# EAGLE design modemIO_v1 (EAGLE 6.2)
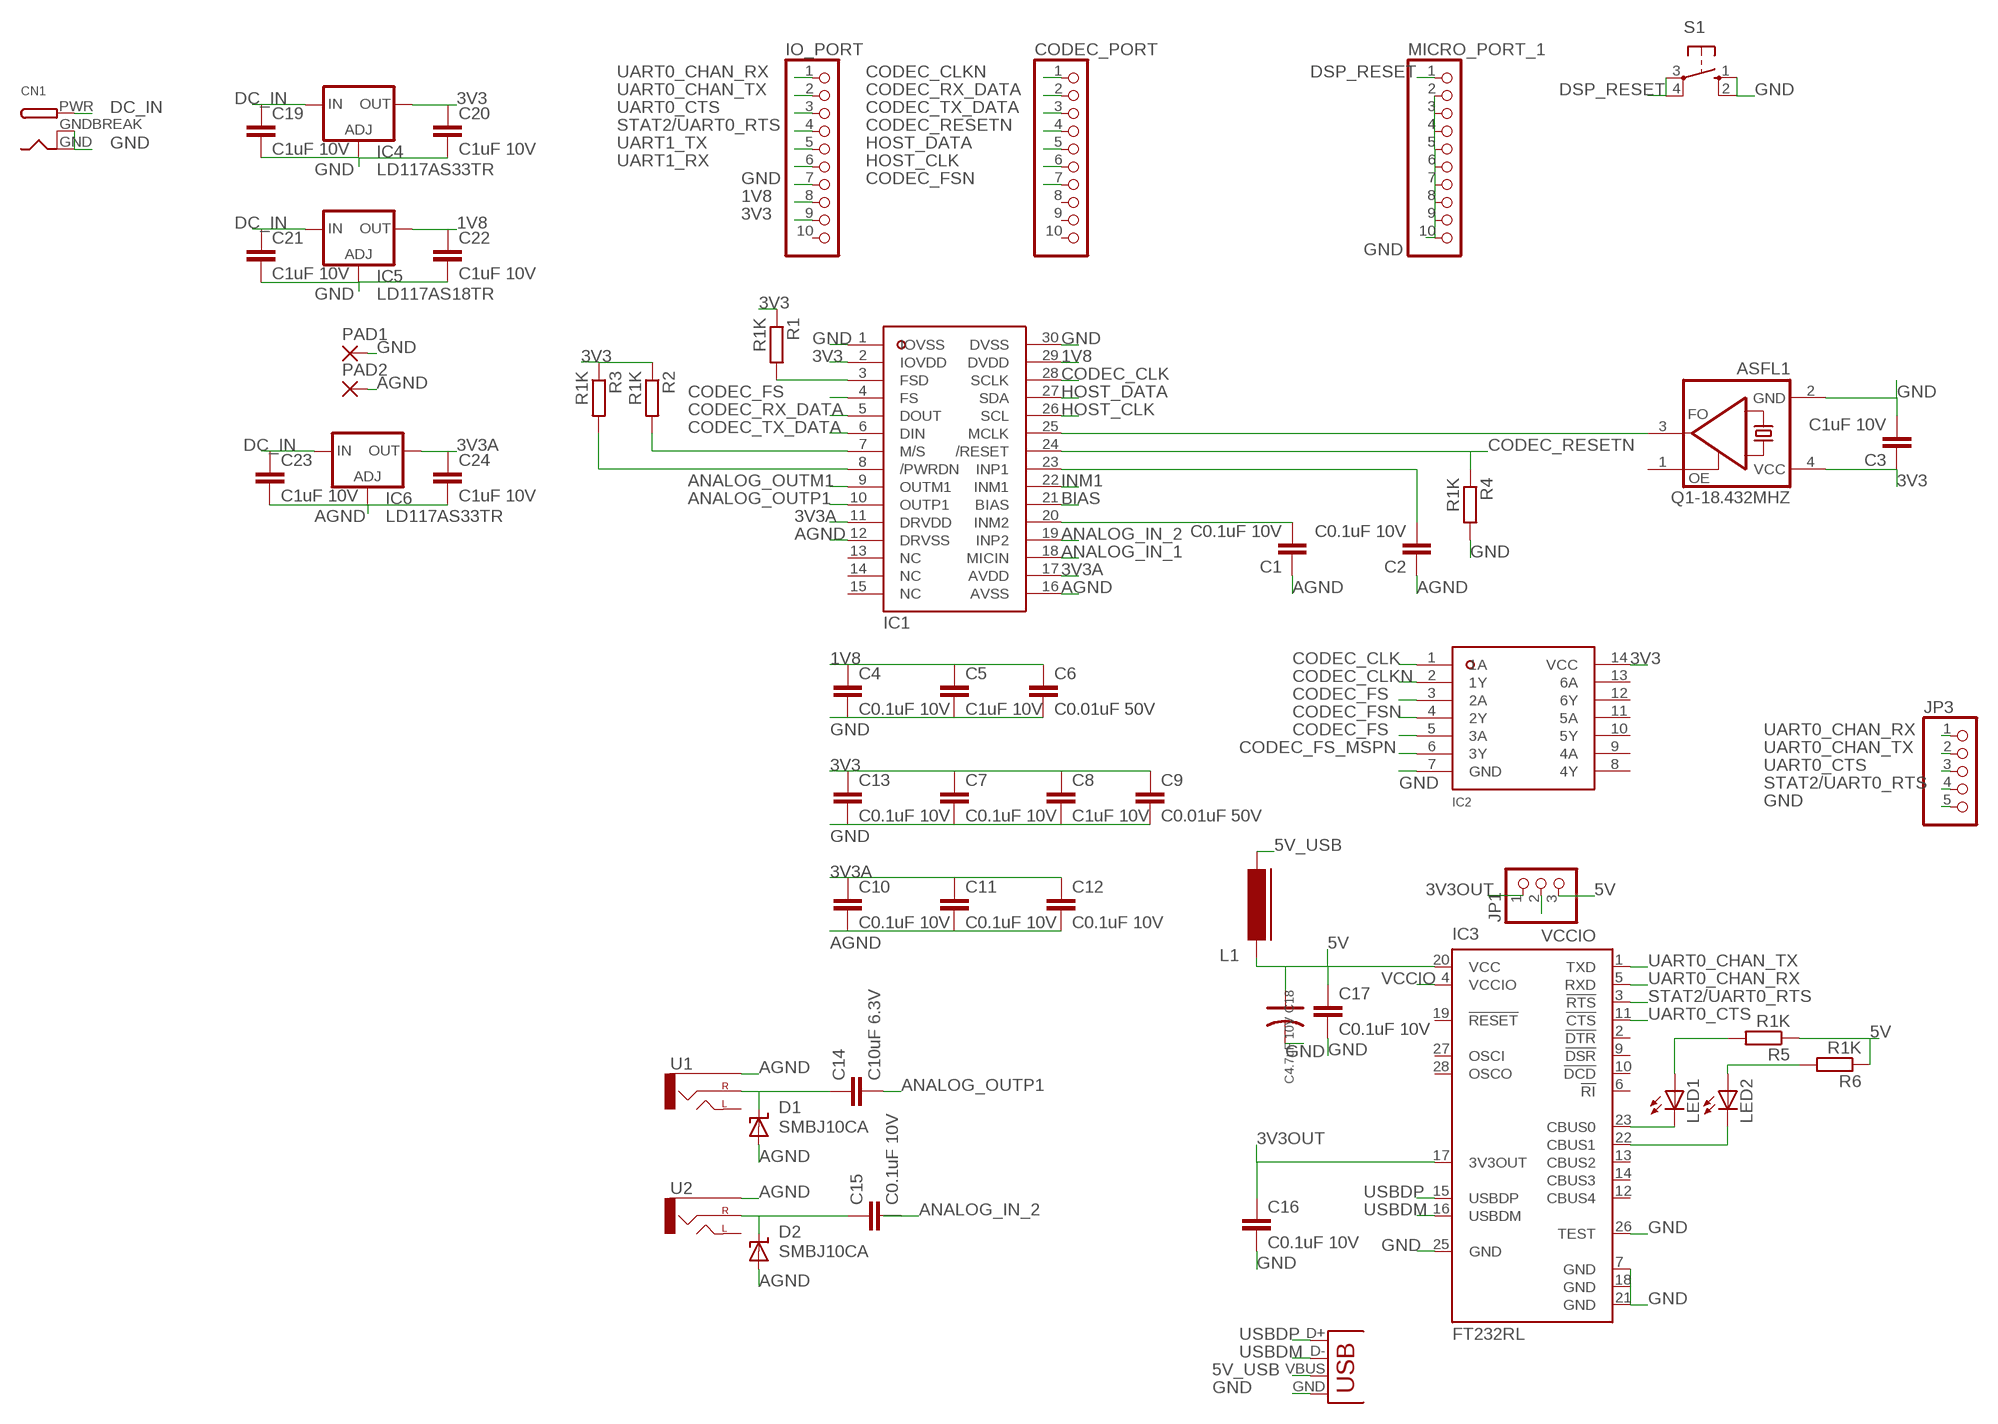
[diagram p0: schematic, sheet 1]

## Parts
C1  C0.1uF 10V  C-EUC0805  [C0805]
C2  C0.1uF 10V  C-EUC0805  [C0805]
C3  C1uF 10V  C-EUC0805  [C0805]
C4  C0.1uF 10V  C-EUC0805  [C0805]
C5  C1uF 10V  C-EUC0805  [C0805]
C6  C0.01uF 50V  C-EUC0805  [C0805]
C7  C0.1uF 10V  C-EUC0805  [C0805]
C8  C1uF 10V  C-EUC0805  [C0805]
C9  C0.01uF 50V  C-EUC0805  [C0805]
C10  C0.1uF 10V  C-EUC0805  [C0805]
C11  C0.1uF 10V  C-EUC0805  [C0805]
C12  C0.1uF 10V  C-EUC0805  [C0805]
C13  C0.1uF 10V  C-EUC0805  [C0805]
C14  C10uF 6.3V  C-EUC0805  [C0805]
C15  C0.1uF 10V  C-EUC0805  [C0805]
C16  C0.1uF 10V  C-EUC0805  [C0805]
C17  C0.1uF 10V  C-EUC0805  [C0805]
C18  C4.7uF 10V  C-POLAR-C  [AVX-C]
C19  C1uF 10V  C-EUC0805  [C0805]
C20  C1uF 10V  C-EUC0805  [C0805]
C21  C1uF 10V  C-EUC0805  [C0805]
C22  C1uF 10V  C-EUC0805  [C0805]
C23  C1uF 10V  C-EUC0805  [C0805]
C24  C1uF 10V  C-EUC0805  [C0805]
CN1  DCBARRELPTH  [DCJACK_2MM_PTH]
CODEC_PORT  PINHD-1X10  [1X10]
D1  SMBJ10CA  SUPPRESSOR-SMBJ  [SMBJ]
D2  SMBJ10CA  SUPPRESSOR-SMBJ  [SMBJ]
IC1  TLV320AIC14R-PDSO-G30  [R-PDSO-G30]
IC2  SN74LVC04ADRR-PDSO-G14  [R-PDSO-G14]
IC3  FT232RL  [SSOP28]
IC4  LD117AS33TR  [SOT223]
IC5  LD117AS18TR  [SOT223]
IC6  LD117AS33TR  [SOT223]
IO_PORT  PINHD-1X10  [1X10]
JP1  PINHD-1X3  [1X03]
JP2  USBSMD  [USB-MINIB]
JP3  PINHD-1X5  [1X05]
L1  FERRITE-0603  [FB603]
LED1  LEDCHIP-LED0805  [CHIP-LED0805]
LED2  LEDCHIP-LED0805  [CHIP-LED0805]
MICRO_PORT_1  PINHD-1X10  [1X10]
PAD1  SMD2  [SMD1,27-2,54]
PAD2  SMD2  [SMD1,27-2,54]
Q1-18.432MHZ  ASFL1  [ASF]
R1  R1K  R-EU_R0805  [R0805]
R2  R1K  R-EU_R0805  [R0805]
R3  R1K  R-EU_R0805  [R0805]
R4  R1K  R-EU_R0805  [R0805]
R5  R1K  R-EU_R0805  [R0805]
R6  R1K  R-EU_R0805  [R0805]
S1  10-XX  [B3F-10XX]
U1  AUDIO-JACKSMD2  [AUDIO-JACK-3.5MM-SMD]
U2  AUDIO-JACKSMD2  [AUDIO-JACK-3.5MM-SMD]

## Nets
1V8: C4.1 C5.1 C6.1 C22.1 IC1.29(DVDD) IC5.4(OUT) IO_PORT.8
3V3: C3.1 C7.1 C8.1 C9.1 C13.1 C20.1 IC1.2(IOVDD) IC2.14(VCC) IC4.4(OUT) IO_PORT.9 Q1-18.432MHZ.4(VCC) R1.1 R2.1 R3.1
3V3A: C10.1 C11.1 C12.1 C24.1 IC1.11(DRVDD) IC1.17(AVDD) IC6.4(OUT)
3V3OUT: C16.1 IC3.17(3V3OUT) JP1.1
5V: C17.1 C18.+ IC3.20(VCC) JP1.3 L1.1 R5.1 R6.1
5V_USB: JP2.VBUS L1.2
AGND: C1.1 C2.1 C10.2 C11.2 C12.2 C23.2 C24.2 D1.A D2.A IC1.12(DRVSS) IC1.16(AVSS) IC6.1(ADJ) PAD2.1(P) U1.SLEEVE U2.SLEEVE
ANALOG_IN_1: IC1.18(MICIN)
ANALOG_IN_2: C15.2 IC1.19(INP2)
ANALOG_OUTM1: IC1.9(OUTM1)
ANALOG_OUTP1: C14.2 IC1.10(OUTP1)
BIAS: IC1.21(BIAS)
CODEC_CLK: IC1.28(SCLK) IC2.1(1A)
CODEC_CLKN: CODEC_PORT.1 IC2.2(1Y)
CODEC_FS: IC1.4(FS) IC2.3(2A) IC2.5(3A)
CODEC_FS_MSPN: IC2.6(3Y)
CODEC_FSN: CODEC_PORT.7 IC2.4(2Y)
CODEC_RESETN: CODEC_PORT.4 IC1.24(/RESET) R4.1
CODEC_RX_DATA: CODEC_PORT.2 IC1.5(DOUT)
CODEC_TX_DATA: CODEC_PORT.3 IC1.6(DIN)
DC_IN: C19.1 C21.1 C23.1 CN1.PWR IC4.3(IN) IC5.3(IN) IC6.3(IN)
DSP_RESET: MICRO_PORT_1.1 S1.3(P) S1.4(P1)
GND: C3.2 C4.2 C5.2 C6.2 C7.2 C8.2 C9.2 C13.2 C16.2 C17.2 C18.- C19.2 C20.2 C21.2 C22.2 CN1.GND CN1.GNDBREAK IC1.1(IOVSS) IC1.30(DVSS) IC2.7(GND) IC3.7(GND) IC3.18(GND) IC3.21(GND) IC3.25(GND) IC3.26(TEST) IC4.1(ADJ) IC5.1(ADJ) IO_PORT.7 JP2.GND JP3.5 MICRO_PORT_1.2 MICRO_PORT_1.3 MICRO_PORT_1.4 MICRO_PORT_1.5 MICRO_PORT_1.6 MICRO_PORT_1.7 MICRO_PORT_1.8 MICRO_PORT_1.9 MICRO_PORT_1.10 PAD1.1(P) Q1-18.432MHZ.2(GND) R4.2 S1.1(S) S1.2(S1)
HOST_CLK: CODEC_PORT.6 IC1.26(SCL)
HOST_DATA: CODEC_PORT.5 IC1.27(SDA)
INM1: IC1.22(INM1)
N$1: C14.1 D1.C U1.RING(RIGHT)
N$2: IC3.23(CBUS0) LED1.C
N$3: IC1.3(FSD) R1.2
N$4: IC3.22(CBUS1) LED2.C
N$5: C15.1 D2.C U2.RING(RIGHT)
N$6: LED1.A R5.2
N$7: IC1.7(M/S) R2.2
N$8: IC1.8(/PWRDN) R3.2
N$9: LED2.A R6.2
N$17: C1.2 IC1.20(INM2)
N$20: C2.2 IC1.23(INP1)
N$22: IC1.25(MCLK) Q1-18.432MHZ.3(FO)
STAT2/UART0_RTS: IC3.3(!RTS) IO_PORT.4 JP3.4
UART0_CHAN_RX: IC3.5(RXD) IO_PORT.1 JP3.1
UART0_CHAN_TX: IC3.1(TXD) IO_PORT.2 JP3.2
UART0_CTS: IC3.11(!CTS) IO_PORT.3 JP3.3
UART1_RX: IO_PORT.6
UART1_TX: IO_PORT.5
USBDM: IC3.16(USBDM) JP2.D-
USBDP: IC3.15(USBDP) JP2.D+
VCCIO: IC3.4(VCCIO) JP1.2
Unconnected: CODEC_PORT.8 CODEC_PORT.9 CODEC_PORT.10 IC1.13(NC) IC1.14(NC) IC1.15(NC) IC2.8(4Y) IC2.9(4A) IC2.10(5Y) IC2.11(5A) IC2.12(6Y) IC2.13(6A) IC3.2(!DTR) IC3.6(!RI) IC3.9(!DSR) IC3.10(!DCD) IC3.12(CBUS4) IC3.13(CBUS2) IC3.14(CBUS3) IC3.19(!RESET) IC3.27(OSCI) IC3.28(OSCO) IO_PORT.10 Q1-18.432MHZ.1(OE) U1.TIP(LEFT) U2.TIP(LEFT)

## Library data of the parts
C1-C17 C19-C24 = resistor:C-EU: CAPACITOR, European symbol
C18 = OPL Eagle Library:C-POLAR*
CN1 = adafruit:DCBARREL: 2.0mm DC Barrel Jack DCJACK_2MM_PTH - Through Hole Jack (4UConnector: 05537)
CODEC_PORT IO_PORT MICRO_PORT_1 = pinhead:PINHD-1X10: PIN HEADER
D1 D2 = diode:SUPPRESSOR-: Suppressor diode
IC1 = TLV320AIC14:TLV320AIC14
IC2 = SN74LVC04ADR:SN74LVC04ADR
IC3 = ftdichip:FT232R: Source: http://www.ftdichip.com/Documents/DataSheets/DS_FT232R_v104.pdf; MPN: FT232RL; OC_FARNELL: 1146032; OC_NEWARK: 91K9918
IC4-IC6 = v-reg:LD117A?*: Low drop fixed and adjustable positive voltage regulators 1 A Source: http://www.st.com/stonline/products/literature/ds/7194/ld1117axx.pdf
JP1 = pinhead:PINHD-1X3: PIN HEADER
JP2 = SparkFun-Connectors:USB: USB Connectors USB-B-PTH is fully proven SKU : PRT-00139/CONN-08278 USB-miniB is fully proven SKU : PRT-00587 USB-A-PCB is untested. USB-A-H is throughly reviewed, but untested. Spark Fun Electronics SKU : PRT-00437 USB-B-SMT is throughly reviewed, but untested. Needs silkscreen touching up. USB-A-S has not been used/tested USB-MB-H has not been used/tested USB-MICROB has been used. CONN-09505
JP3 = pinhead:PINHD-1X5: PIN HEADER
L1 = dp_devices:FERRITE: Ferrite bead in various packages
LED1 LED2 = led:LED: LED OSRAM: - CHIPLED LG R971, LG N971, LY N971, LG Q971, LY Q971, LO R971, LY R971 LH N974, LH R974 LS Q976, LO Q976, LY Q976 LO Q996 - Hyper CHIPLED LW Q18S LB Q993, LB Q99A, LB R99A - SideLED LS A670, LO A670, LY A670, LG A670, LP A670 LB A673, LV A673, LT A673, LW A673 LH A674 LY A675 LS A676, LA A676, LO A676, LY A676, LW A676 LS A679, LY A679, LG A679 - Hyper Micro SIDELED® LS Y876, LA Y876, LO Y876, LY Y876 LT Y87S - SmartLED LW L88C, LW L88S LB L89C, LB L89S, LG L890 LS L89K, LO L89K, LY L89K LS L896, LA L896, LO L896, LY L896 - TOPLED LS T670, LO T670, LY T670, LG T670, LP T670 LSG T670, LSP T670, LSY T670, LOP T670, LYG T670 LG T671, LOG T671, LSG T671 LB T673, LV T673, LT T673, LW T673 LH T674 LS T676, LA T676, LO T676, LY T676, LB T676, LH T676, LSB T676, LW T676 LB T67C, LV T67C, LT T67C, LS T67K, LO T67K, LY T67K, LW E67C LS E67B, LA E67B, LO E67B, LY E67B, LB E67C, LV E67C, LT E67C LW T67C LS T679, LY T679, LG T679 LS T770, LO T770, LY T770, LG T770, LP T770 LB T773, LV T773, LT T773, LW T773 LH T774 LS E675, LA E675, LY E675, LS T675 LS T776, LA T776, LO T776, LY T776, LB T776 LHGB T686 LT T68C, LB T68C - Hyper Mini TOPLED® LB M676 - Mini TOPLED Santana® LG M470 LS M47K, LO M47K, LY M47K Source: http://www.osram.convergy.de LUXEON: - LUMILED® LXK2-PW12-R00, LXK2-PW12-S00, LXK2-PW14-U00, LXK2-PW14-V00 LXK2-PM12-R00, LXK2-PM12-S00, LXK2-PM14-U00 LXK2-PE12-Q00, LXK2-PE12-R00, LXK2-PE12-S00, LXK2-PE14-T00, LXK2-PE14-U00 LXK2-PB12-K00, LXK2-PB12-L00, LXK2-PB12-M00, LXK2-PB14-N00, LXK2-PB14-P00, LXK2-PB14-Q00 LXK2-PR12-L00, LXK2-PR12-M00, LXK2-PR14-Q00, LXK2-PR14-R00 LXK2-PD12-Q00, LXK2-PD12-R00, LXK2-PD12-S00 LXK2-PH12-R00, LXK2-PH12-S00 LXK2-PL12-P00, LXK2-PL12-Q00, LXK2-PL12-R00 Source: www.luxeon.com KINGBRIGHT: KA-3528ASYC Source: www.kingbright.com
PAD1 PAD2 = wirepad:SMD2: SMD PAD
Q1-18.432MHZ = crystal:ASF*: CRYSTAL CLOCK OSCILLATORS 5.0 Vdc or 3.3 Vdc - LOW PROFILE ULTRA MINIATURE CERAMIC SURFACE MOUNT Source: http://www.abracon.com/Oscillators/asf1-L-L1.pdf; MF: Abracon Corporation; MPN: ASFL1-125.000MHZ-EC-T; OC_FARNELL: 1838931; OC_NEWARK: 19M1882
R1-R6 = resistor:R-EU_: RESISTOR, European symbol
S1 = switch-omron:10-XX: OMRON SWITCH; MPN: B3F-1000; OC_FARNELL: 176432; OC_NEWARK: 36M3542
U1 U2 = SparkFun-Connectors:AUDIO-JACK: 3.5mm Audio Jack Simple 3.5mm common PCB mount audio jack. SKU: PRT-08032

## Board
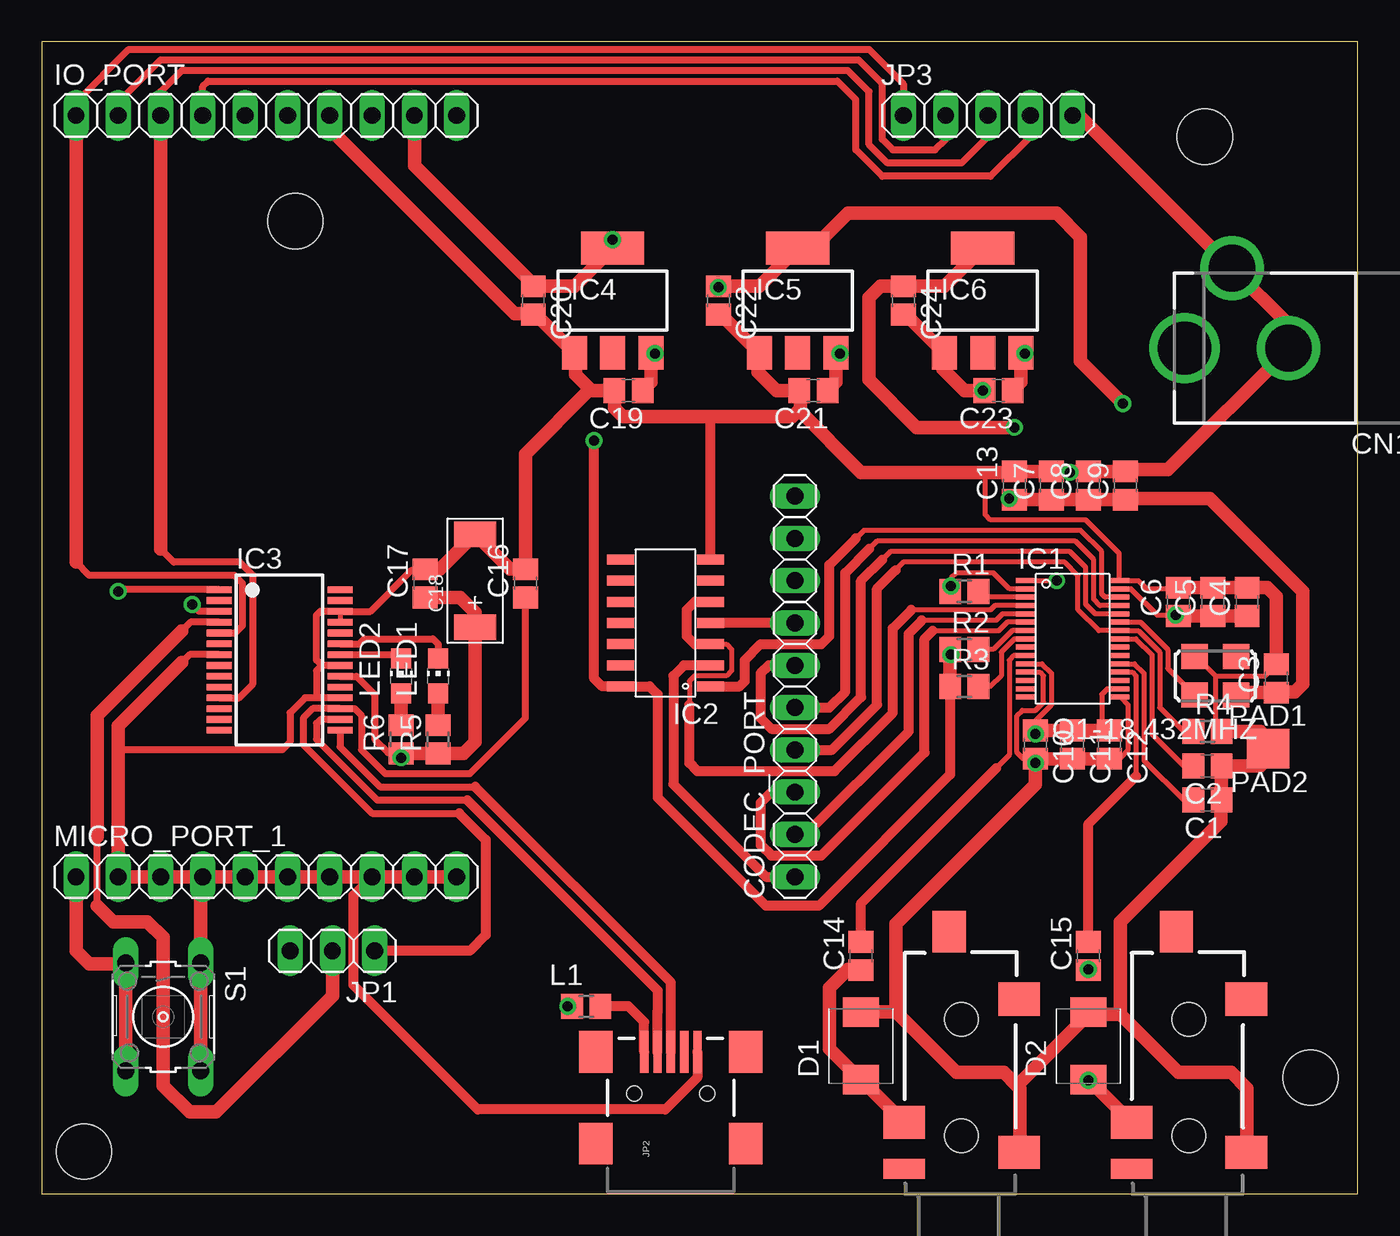
[diagram p1: board, top side]
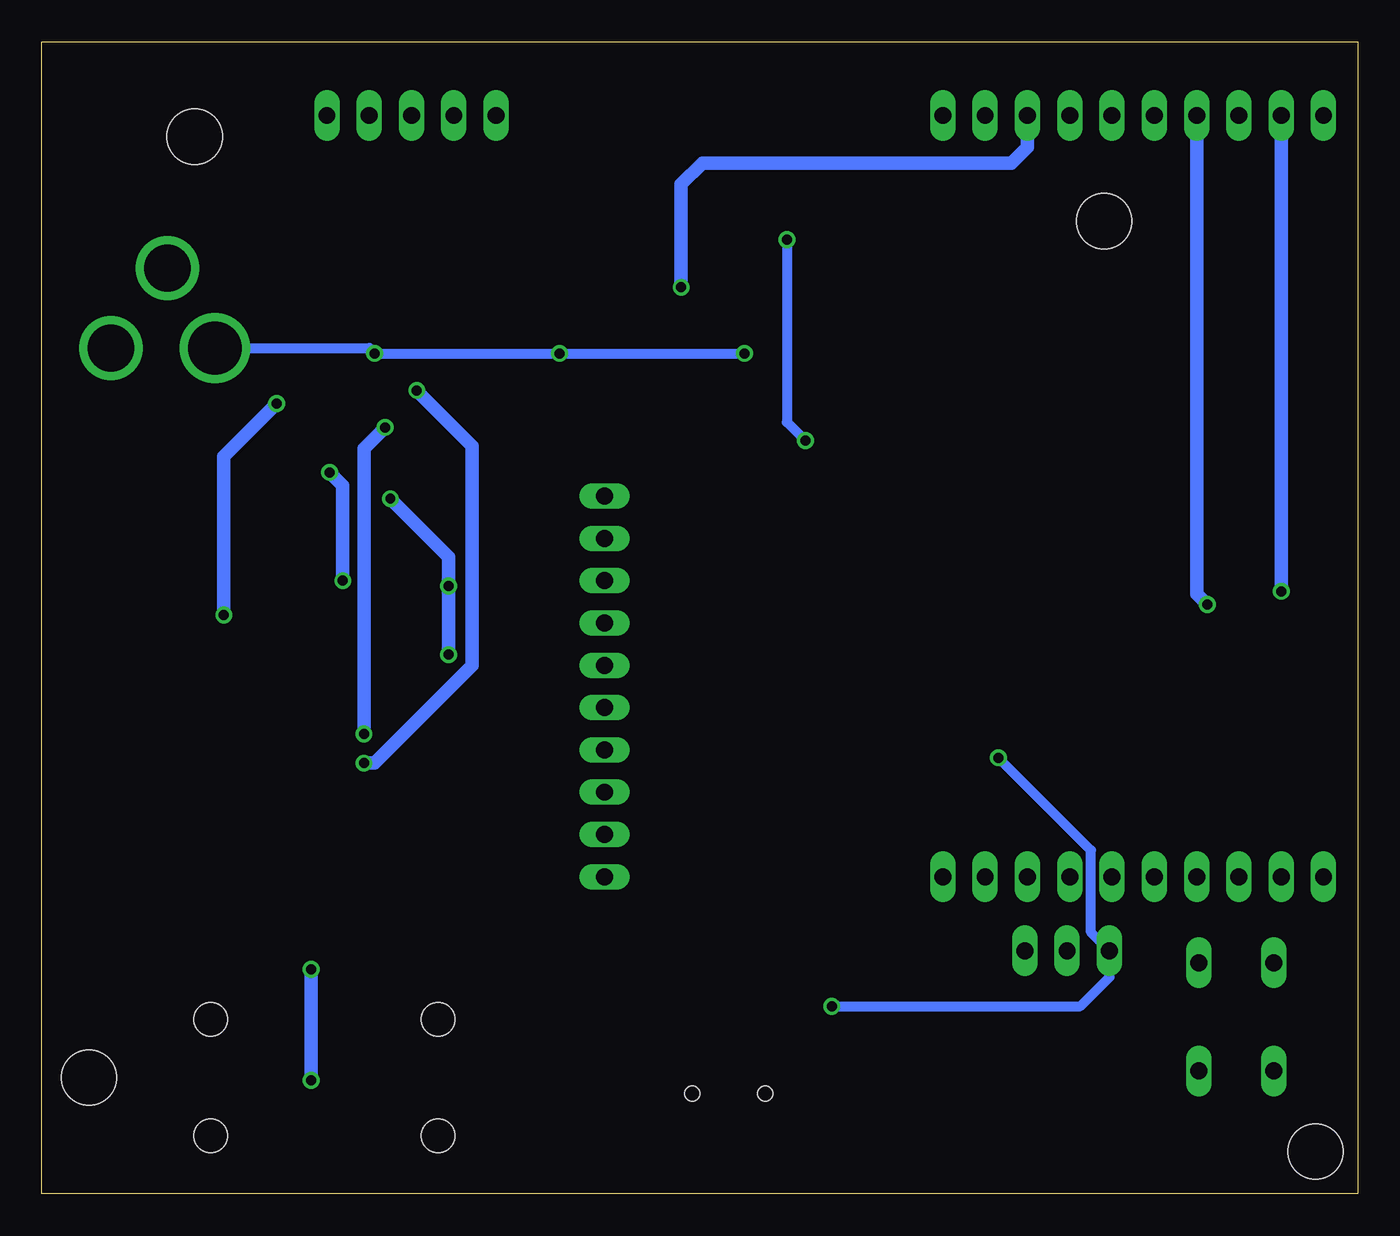
[diagram p2: board, bottom side, seen from below]

Size 79.05 x 69.2 mm. Coordinates in mm from the lower left corner, seen from the top.
Outline: 0,0 79.05,0 79.05,69.2 0,69.2 0,0
Copper layers (1*16): Top 0.035mm / dielectric 1.5mm / Bottom 0.035mm
Design rules: minimum track width 10mil, minimum drill 24mil, track to track 8mil, track to pad 8mil, pad to pad 8mil, via to via 8mil, smd to smd 8mil, copper to edge 40mil, drill to drill 8mil, minimum pad ring 10mil, minimum via ring 8mil, stop-mask expansion 4mil, vias tented up to drill 0mil, thermal gap 10mil
Holes 3.3 mm at 2.54,2.54 76.2,6.99 69.85,63.5 15.24,58.42

### Footprints (pad centres in the part's own frame; a part is rotated, then mirrored left to right if it is on the bottom)
C0805 = smd 1.3 x 1.5: 1 -0.85,0; 2 0.85,0
AVX-C = smd 1.524 x 2.54: + -2.794,0; - 2.794,0
DCJACK_2MM_PTH = drill 2.8: GND 0,7.35; GNDBREAK 4.8,10.75 | drill 3.2: PWR 0,13.6
1X10 = drill 1.016 long: 1 -11.43,0; 2 -8.89,0; 3 -6.35,0; 4 -3.81,0; 5 -1.27,0; 6 1.27,0; 7 3.81,0; 8 6.35,0; 9 8.89,0; 10 11.43,0
SMBJ = smd 1.78 x 2.16: A 2.04,0; C -2.03,0
R-PDSO-G30 = smd 0.3 x 1.2: 1 -3.5,-2.8; 2 -3,-2.8; 3 -2.5,-2.8; 4 -2,-2.8; 5 -1.5,-2.8; 6 -1,-2.8; 7 -0.5,-2.8; 8 0,-2.8; 9 0.5,-2.8; 10 1,-2.8; 11 1.5,-2.8; 12 2,-2.8; 13 2.5,-2.8; 14 3,-2.8; 15 3.5,-2.8; 16 3.5,2.8; 17 3,2.8; 18 2.5,2.8; 19 2,2.8; 20 1.5,2.8; 21 1,2.8; 22 0.5,2.8; 23 0,2.8; 24 -0.5,2.8; 25 -1,2.8; 26 -1.5,2.8; 27 -2,2.8; 28 -2.5,2.8; 29 -3,2.8; 30 -3.5,2.8
R-PDSO-G14 = smd 0.6 x 1.6: 1 -3.81,-2.7; 2 -2.54,-2.7; 3 -1.27,-2.7; 4 0,-2.7; 5 1.27,-2.7; 6 2.54,-2.7; 7 3.81,-2.7; 8 3.81,2.7; 9 2.54,2.7; 10 1.27,2.7; 11 0,2.7; 12 -1.27,2.7; 13 -2.54,2.7; 14 -3.81,2.7
SSOP28 = smd 0.4 x 1.5: 1 -4.225,-3.625; 2 -3.575,-3.625; 3 -2.925,-3.625; 4 -2.275,-3.625; 5 -1.625,-3.625; 6 -0.975,-3.625; 7 -0.325,-3.625; 8 0.325,-3.625; 9 0.975,-3.625; 10 1.625,-3.625; 11 2.275,-3.625; 12 2.925,-3.625; 13 3.575,-3.625; 14 4.225,-3.625; 15 4.225,3.625; 16 3.575,3.625; 17 2.925,3.625; 18 2.275,3.625; 19 1.625,3.625; 20 0.975,3.625; 21 0.325,3.625; 22 -0.325,3.625; 23 -0.975,3.625; 24 -1.625,3.625; 25 -2.275,3.625; 26 -2.925,3.625; 27 -3.575,3.625; 28 -4.225,3.625
SOT223 = smd 1.5 x 2: 1 -2.3,-3.15; 2 0,-3.15; 3 2.3,-3.15 | smd 3.8 x 2: 4 0,3.15
1X03 = drill 1.016 long: 1 -2.54,0; 2 0,0; 3 2.54,0
USB-MINIB = smd 2.5 x 0.5: D+ 2.5,0; D- 2.5,0.8; GND 2.5,-1.6; ID 2.5,-0.8; VBUS 2.5,1.6 | smd 2.5 x 2: MTN1 -3,4.5; MTN2 2.5,4.5; MTN3 -3,-4.5; MTN4 2.5,-4.5 | hole 0.9: 0,2.2; 0,-2.2
1X05 = drill 1.016 long: 1 -5.08,0; 2 -2.54,0; 3 0,0; 4 2.54,0; 5 5.08,0
FB603 = smd 1.3 x 1.5: 1 -0.85,0; 2 0.85,0
CHIP-LED0805 = smd 1.2 x 1.2: A 0,-1.05; C 0,1.05
SMD1,27-2,54 = smd 1.27 x 2.54: 1 0,0
ASF = smd 1.6 x 1.5: 1 -1.25,-1.15; 2 1.25,-1.15; 3 1.25,1.15; 4 -1.25,1.15
R0805 = smd 1.3 x 1.5: 1 -0.85,0; 2 0.85,0
B3F-10XX = drill 1.016 long: 1 -3.251,2.261; 2 3.251,2.261; 3 -3.251,-2.261; 4 3.251,-2.261
AUDIO-JACK-3.5MM-SMD = smd 2 x 2.5: RING 4.3,3.45; SLEEVE 2.5,-3.45; TIP 11.7,-3.45 | smd 1.2 x 2.5: RSH 1.5,3.45 | smd 2.5 x 2: TSH 15.75,0.75 | hole 2: 3.5,0; 10.5,0

### Placement (x,y rotation side)
C1  70.01,23.65 180 top
C2  70.01,25.72 180 top
C3  74.14,30.96 90 top
C4  72.39,35.56 90 top
C5  70.33,35.56 90 top
C6  68.26,35.56 90 top
C7  60.64,42.55 90 top
C8  62.87,42.55 90 top
C9  65.09,42.55 90 top
C10  59.69,26.99 270 top
C11  61.91,26.99 270 top
C12  64.14,26.99 270 top
C13  58.42,42.55 90 top
C14  49.21,14.29 90 top
C15  62.87,14.29 90 top
C16  29.05,36.67 90 top
C17  23.02,36.67 90 top
C18  26.04,36.83 90 top
C19  35.24,48.26 180 top
C20  29.53,53.66 270 top
C21  46.35,48.26 180 top
C22  40.64,53.66 270 top
C23  57.47,48.26 180 top
C24  51.75,53.66 270 top
CN1  82.23,50.8 90 top
CODEC_PORT  45.24,30.48 90 top
D1  49.21,8.89 90 top
D2  62.87,8.89 90 top
IC1  61.91,33.34 270 top
IC2  37.47,34.29 90 top
IC3  14.29,32.07 270 top
IC4  34.29,53.66 0 top
IC5  45.4,53.66 0 top
IC6  56.52,53.66 0 top
IO_PORT  13.49,64.77 0 top
JP1  17.46,14.61 180 top
JP2  37.78,6.03 90 top
JP3  56.83,64.77 0 top
L1  32.7,11.27 0 top
LED1  23.81,31.11 0 top
LED2  21.59,31.11 0 top
MICRO_PORT_1  13.49,19.05 0 top
PAD1  73.66,27.3 270 top
PAD2  73.66,26.19 90 top
Q1-18.432MHZ  70.48,31.11 180 top
R1  55.4,36.2 0 top
R2  55.4,32.7 0 top
R3  55.4,30.48 0 top
R4  70.01,27.78 0 top
R5  23.81,27.3 90 top
R6  21.59,27.3 90 top
S1  7.3,10.64 270 top
U1  55.24,0 90 top
U2  68.9,0 90 top

### Tracks (layer width: path | path; a pad name or v marks a point on that pad's centre or on a via)
1V8  (via drill 0.6)
  Top 0.305: IC1.29 65.42,36.34 66.99,34.77 v68.1,34.77
  Top 0.813: C4.1 C5.1 C6.1 68.21,34.77 v68.1,34.77 | v64.93,47.47 62.39,50.01 62.39,57.47 60.96,58.9 48.42,58.9 46.33,56.81 IC5.4 43.1,54.51 C22.1 v40.64,54.45
  Bottom 0.813: IO_PORT.8 19.84,62.87 20.8,61.91 39.37,61.91 40.64,60.64 v40.64,54.45 | v68.1,34.77 68.1,44.29 v64.93,47.47
3V3  (via drill 0.6)
  Top 0.305: IC1.2 58.12,36.34 57.15,37.31 54.93,37.31 54.61,36.99 v54.61,36.51 54.61,36.25 R1.1
  Top 0.61: R3.1 54.55,25.18 46.67,17.3 43.5,17.3 36.99,23.81 36.99,30 36.51,30.48 IC2.14 33.66,30.48 33.18,30.96 v33.18,45.24 | v34.29,57.31 IC4.4
  Top 0.813: Q1-18.432MHZ.4 71.88,30.11 C3.1 74.19,30.16 75.25,30.16 75.72,30.64 75.72,36.2 70.17,41.75 65.14,41.75 C9.1 C8.1 C7.1 C13.1 58.36,41.75 v58.1,41.75 | IC4.4 31.99,54.51 C20.1 29.21,54.83 29.21,54.93 22.38,61.75 IO_PORT.9 | R3.1 54.55,32.33 v54.61,32.38 54.55,32.44 R2.1
  Bottom 0.61: v34.29,57.31 34.29,46.35 v33.18,45.24
  Bottom 0.813: v54.61,32.38 v54.61,36.51 54.61,38.26 v58.1,41.75
3V3A  (via drill 0.6)
  Top 0.305: C10.1 59.69,28.42 60.64,29.37 60.64,31.27 60.08,31.84 IC1.11 | IC1.17 63.99,30.34 63.66,30 63.66,28.31 C12.1
  Top 0.813: C12.1 C11.1 C10.1 v59.69,27.62 | IC6.4 54.22,54.51 C24.1 50.38,54.51 49.69,53.82 49.69,48.9 52.55,46.04 v58.42,46.04
  Bottom 0.813: v59.69,27.62 59.69,44.77 v58.42,46.04
3V3OUT
  Top 0.406: C16.1 29.05,28.57 25.72,25.24 20.64,25.24 19.21,26.67 19.21,28.73 18.8,29.14 IC3.17 16.28,29.14 15.72,28.57 15.72,26.99 19.84,22.86 25.08,22.86
  Top 0.61: JP1.1 25.72,14.61 26.67,15.56 26.67,21.27 25.08,22.86
5V  (via drill 0.6)
  Top 0.406: IC3.20 18.91,31.09 20,30 20,27.3 20.8,26.51 21.53,26.51 R6.1
  Top 0.813: C17.1 25.14,35.82 26.04,34.92 C18.+ 26.04,27.15 25.34,26.45 R5.1 R6.1 v21.59,26.19 | v31.59,11.27 L1.1
  Bottom 0.61: v21.59,26.19 16.03,20.64 16.03,15.72 JP1.3 14.92,13.02 16.67,11.27 v31.59,11.27
5V_USB
  Top 0.61: JP2.VBUS 36.18,10.33 35.24,11.27 L1.2
AGND  (via drill 0.6)
  Top 0.305: IC1.16 64.78,29.84 65.25,29.37 65.25,26.67 64.77,26.19 64.19,26.19 C12.2 | C10.2 58.95,26.14 58.58,26.51 58.58,28.73 58.9,29.05 59.69,29.05 60.17,29.53 60.17,31.11 59.94,31.34 IC1.12
  Top 0.813: 51.3,10.93 54.93,7.3 57.78,7.3 58.58,6.51 | 58.58,6.51 58.74,6.35 58.74,2.54 U1.SLEEVE | D2.A 62.87,10.79 | 62.87,10.79 58.58,6.51 | 62.87,10.79 64.77,10.79 | 64.77,10.79 68.26,7.3 71.44,7.3 72.39,6.35 72.39,2.54 U2.SLEEVE | C12.2 C11.2 C10.2 59.53,25.98 59.59,25.98 v59.69,25.88 59.69,24.61 51.3,16.22 51.3,10.93 | 64.77,10.79 64.77,16.35 70.8,22.38 70.8,23.6 C1.1 C2.1 73.18,25.72 PAD2.1 | 51.3,10.93 D1.A | C24.2 51.91,52.81 IC6.1 54.13,50.43 54.13,49.53 55.4,48.26 v56.52,48.26 C23.2
  Bottom 0.813: v59.69,25.88 59.05,25.88 53.18,31.75 53.18,44.93 v56.52,48.26
ANALOG_IN_2
  Top 0.305: IC1.19 65.5,31.34 65.72,31.11 65.72,25.08
  Top 0.61: C15.2 62.87,22.23 65.72,25.08
ANALOG_OUTP1
  Top 0.305: IC1.10 58.37,32.34 58.1,32.07 58.1,26.35 57.31,25.56
  Top 0.61: C14.2 49.21,17.46 57.31,25.56
CODEC_CLK
  Top 0.305: IC1.28 63.86,35.84 63.66,36.04 63.66,38.58 62.39,39.85 49.37,39.85 48.9,39.37
  Top 0.61: 48.9,39.37 47.31,37.78 47.31,33.5 46.83,33.02 43.18,33.02 42.23,32.07 42.23,30.8 41.91,30.48 IC2.1
CODEC_CLKN
  Top 0.61: IC2.2 38.58,31.75 37.94,31.11 37.94,24.61 43.5,19.05 CODEC_PORT.1
CODEC_FS
  Top 0.305: IC1.4 57.24,35.34 56.99,35.08 52.23,35.08 | IC2.3 41.12,33.02 41.43,32.7 41.43,31.43 41.12,31.11 39.21,31.11 38.89,30.8 38.89,29.37
  Top 0.61: 52.23,35.08 51.12,33.97 51.12,28.89 47.62,25.4 39.37,25.4 38.89,25.88 38.89,29.37 | IC2.5 39.21,35.56 38.73,35.08 38.73,33.5 39.21,33.02 IC2.3
CODEC_FSN
  Top 0.61: CODEC_PORT.7 IC2.4
CODEC_RESETN
  Top 0.305: R4.1 68.58,27.78 67.15,29.21 67.15,32.54 65.86,33.84 IC1.24 63.48,33.84 62.23,35.08 62.23,37.15 61.44,37.94 51.75,37.94 51.28,37.47
  Top 0.61: CODEC_PORT.4 47.47,26.67 50.16,29.37 50.16,36.35 51.28,37.47
CODEC_RX_DATA
  Top 0.305: IC1.5 57.7,34.84 57.31,34.45 52.86,34.45
  Top 0.61: CODEC_PORT.2 45.88,21.59 52.07,27.78 52.07,33.66 52.86,34.45
CODEC_TX_DATA
  Top 0.305: IC1.6 57.99,34.34 57.47,33.81 53.5,33.81
  Top 0.61: CODEC_PORT.3 43.81,24.13 43.18,23.5 43.18,20.95 43.81,20.32 46.83,20.32 53.02,26.51 53.02,33.34 53.5,33.81
DC_IN  (via drill 0.6)
  Top 0.813: C19.1 36.59,48.76 IC4.3 36.62,50.48 v36.83,50.48 | C21.1 47.7,48.76 IC5.3 47.92,50.51 v47.94,50.48 | C23.1 58.81,48.76 IC6.3 58.84,50.48 v59.05,50.48
  Bottom 0.61: v36.83,50.48 v47.94,50.48 v59.05,50.48 59.37,50.8 CN1.PWR
DSP_RESET
  Top 0.813: MICRO_PORT_1.1 2.06,14.61 2.86,13.81 4.97,13.81 S1.3 S1.4
GND  (via drill 0.6)
  Top 0.305: C6.2 68.21,36.35 66.36,36.35 65.87,36.84 IC1.30 64.71,38.48 62.71,40.48 56.99,40.48 56.67,40.8 56.67,43.34 | Q1-18.432MHZ.2 69.33,32.27 70.48,31.11 | 70.48,31.11 70.48,28.16 R4.2 | IC3.26 IC3.25 | 70.48,31.11 73.44,31.11 C3.2 | IC1.1 v60.95,36.84 v60.96,36.83
  Top 0.406: C17.2 22.96,37.47 22.23,37.47 19.75,34.99 IC3.26 16.74,34.99 16.51,34.77 16.51,32.07 16.82,31.76 16.82,31.74 | IC3.21 16.82,31.74 | 16.82,31.74 16.51,31.43 16.51,29.79 | IC3.7 8.9,32.39 8.41,31.91 | IC3.18 16.51,29.79 | 16.51,29.79 15.82,29.79 14.92,28.89 14.92,27.15 14.45,26.67 4.6,26.67
  Top 0.61: JP2.GND 39.38,7 37.47,5.08 26.19,5.08 18.73,12.54 18.73,17.94 MICRO_PORT_1.8 | IC2.7 40.16,46.67
  Top 0.813: C6.2 C5.2 C4.2 73.6,36.41 74.14,35.88 C3.2 | MICRO_PORT_1.4 9.56,18.93 S1.1 S1.2 | C17.2 23.93,37.52 C18.- 28.14,37.52 C16.2 29.05,44.45 32.94,48.34 | 8.41,31.91 4.6,28.1 4.6,26.67 MICRO_PORT_1.2 MICRO_PORT_1.3 MICRO_PORT_1.4 | MICRO_PORT_1.4 MICRO_PORT_1.5 MICRO_PORT_1.6 MICRO_PORT_1.7 MICRO_PORT_1.8 MICRO_PORT_1.9 MICRO_PORT_1.10 | 32.94,48.34 33.02,48.26 C19.2 34.39,47.2 34.92,46.67 40.16,46.67 45.09,46.67 45.48,47.07 | 32.94,48.34 32.07,49.21 32.07,50.43 IC4.1 29.69,52.81 C20.2 29.47,52.86 28.42,52.86 17.3,63.98 IO_PORT.7 | C22.2 40.8,52.81 IC5.1 43.02,50.43 43.02,49.37 44.13,48.26 C21.2 45.56,48.2 45.56,47.15 45.48,47.07 | JP3.5 62.31,64.77 CN1.GNDBREAK 74.88,52.2 CN1.GND 74.88,50.75 67.63,43.5 65.19,43.5 C9.2 C8.2 61.81,43.4 v61.75,43.34 61.7,43.4 C7.2 C13.2 58.36,43.34 56.67,43.34 49.21,43.34 45.48,47.07 | R4.2 73.18,27.78 PAD1.1
  Bottom 0.813: v60.96,36.83 60.96,42.55 v61.75,43.34
HOST_CLK
  Top 0.305: IC1.26 63.27,34.84 62.71,35.4 62.71,37.62 61.75,38.58 50.96,38.58 50.48,38.1
  Top 0.61: CODEC_PORT.6 43.66,31.75 43.18,31.27 43.18,28.57 43.81,27.94 47.31,27.94 49.21,29.84 49.21,36.83 50.48,38.1
HOST_DATA
  Top 0.305: IC1.27 63.56,35.34 63.18,35.72 63.18,38.1 62.07,39.21 50.16,39.21 49.69,38.73
  Top 0.61: CODEC_PORT.5 47.31,29.21 48.26,30.16 48.26,37.31 49.69,38.73
N$1
  Top 0.813: U1.RING 49.23,6.86 D1.C 49.18,6.86 47.31,8.73 47.31,12.38 48.42,13.49 49.16,13.49 C14.1
N$2
  Top 0.406: IC3.23 19.07,33.04 19.37,33.34 23.5,33.34 23.81,33.02 LED1.C
N$3
  Top 0.305: IC1.3 56.61,35.84 R1.2
N$4
  Top 0.406: IC3.22 21.36,32.39 LED2.C
N$5  (via drill 0.6)
  Top 0.61: v62.87,13.49 C15.1
  Top 0.813: U2.RING 62.89,6.86 D2.C v62.87,6.83
  Bottom 0.813: v62.87,13.49 v62.87,6.83
N$6
  Top 0.813: LED1.A R5.2
N$7
  Top 0.305: IC1.7 58.28,33.84 57.15,32.7 R2.2
N$8
  Top 0.305: IC1.8 58.42,33.34 57.63,32.54 57.63,31.11 56.99,30.48 R3.2
N$9
  Top 0.813: LED2.A R6.2
N$17
  Top 0.305: IC1.20 65.64,31.84 66.2,31.27 66.2,26.04 68.58,23.65 C1.2
N$20
  Top 0.305: IC1.23 65.72,33.34 66.67,32.38 66.67,27.62 68.58,25.72 C2.2
N$22
  Top 0.305: IC1.25 65.99,34.34 67.63,32.7 67.63,31.57 Q1-18.432MHZ.3
STAT2/UART0_RTS  (via drill 0.6)
  Top 0.406: IO_PORT.4 9.68,66.52 10,66.83 47.78,66.83 48.9,65.72 48.9,62.71 50.48,61.12 56.99,61.12 59.37,63.5 JP3.4 | IC3.3 9.46,34.99 v9.05,35.4
  Bottom 0.813: IO_PORT.4 9.68,36.04 v9.05,35.4
UART0_CHAN_RX
  Top 0.406: IO_PORT.1 2.06,65.56 5.24,68.74 49.69,68.74 51.75,66.67 JP3.1 | IC3.5 11.63,33.69 12.06,34.13 12.06,36.67 11.59,37.15 2.86,37.15 2.06,37.94
  Top 0.813: IO_PORT.1 2.06,37.94
UART0_CHAN_TX  (via drill 0.6)
  Top 0.406: IO_PORT.2 4.6,65.56 7.14,68.1 49.05,68.1 50.48,66.67 50.48,63.34 51.12,62.71 53.66,62.71 54.29,63.34 JP3.2 | IC3.1 4.7,36.29 v4.6,36.2
  Bottom 0.813: IO_PORT.2 v4.6,36.2
UART0_CTS
  Top 0.406: IO_PORT.3 7.14,66.2 8.41,67.47 48.42,67.47 49.69,66.2 49.69,63.02 50.8,61.91 55.24,61.91 56.83,63.5 JP3.3 | IC3.11 11.85,29.79 12.7,30.64 12.7,37.15 11.91,37.94 7.94,37.94 7.14,38.73
  Top 0.813: 7.14,38.73 IO_PORT.3
USBDM
  Top 0.406: IC3.16 16.75,28.49 16.51,28.26 16.51,27.3 20.16,23.65 25.56,23.65
  Top 0.61: JP2.D- 36.98,10.96 36.99,10.97 36.99,12.22 25.56,23.65
USBDP
  Top 0.406: IC3.15 17.91,26.86 20.32,24.45 26.04,24.45
  Top 0.61: JP2.D+ 37.78,12.7 26.04,24.45
VCCIO
  Top 0.406: IC3.4 8.94,34.34 8.41,33.81 | 3.33,17.3 3.33,21.43
  Top 0.813: 3.33,17.3 4.29,16.35 6.35,16.35 7.3,15.4 7.3,6.51 8.89,4.92 10.48,4.92 17.46,11.91 JP1.2 | 3.33,21.43 3.33,28.73 8.41,33.81